# EasyEDA Pro project WEN正负电源LM27762.epro

# Schematic Schematic4
Board Name: 正负电源LM27762; Create Date: 2025-03-25; Page Name: P1; Project Name: 2025电赛预制模块mmkk; Schematic Name: Schematic4; Update Date: 2025-03-25; Company: 嘉立创EDA; Page Size: A1; Version: V1.0
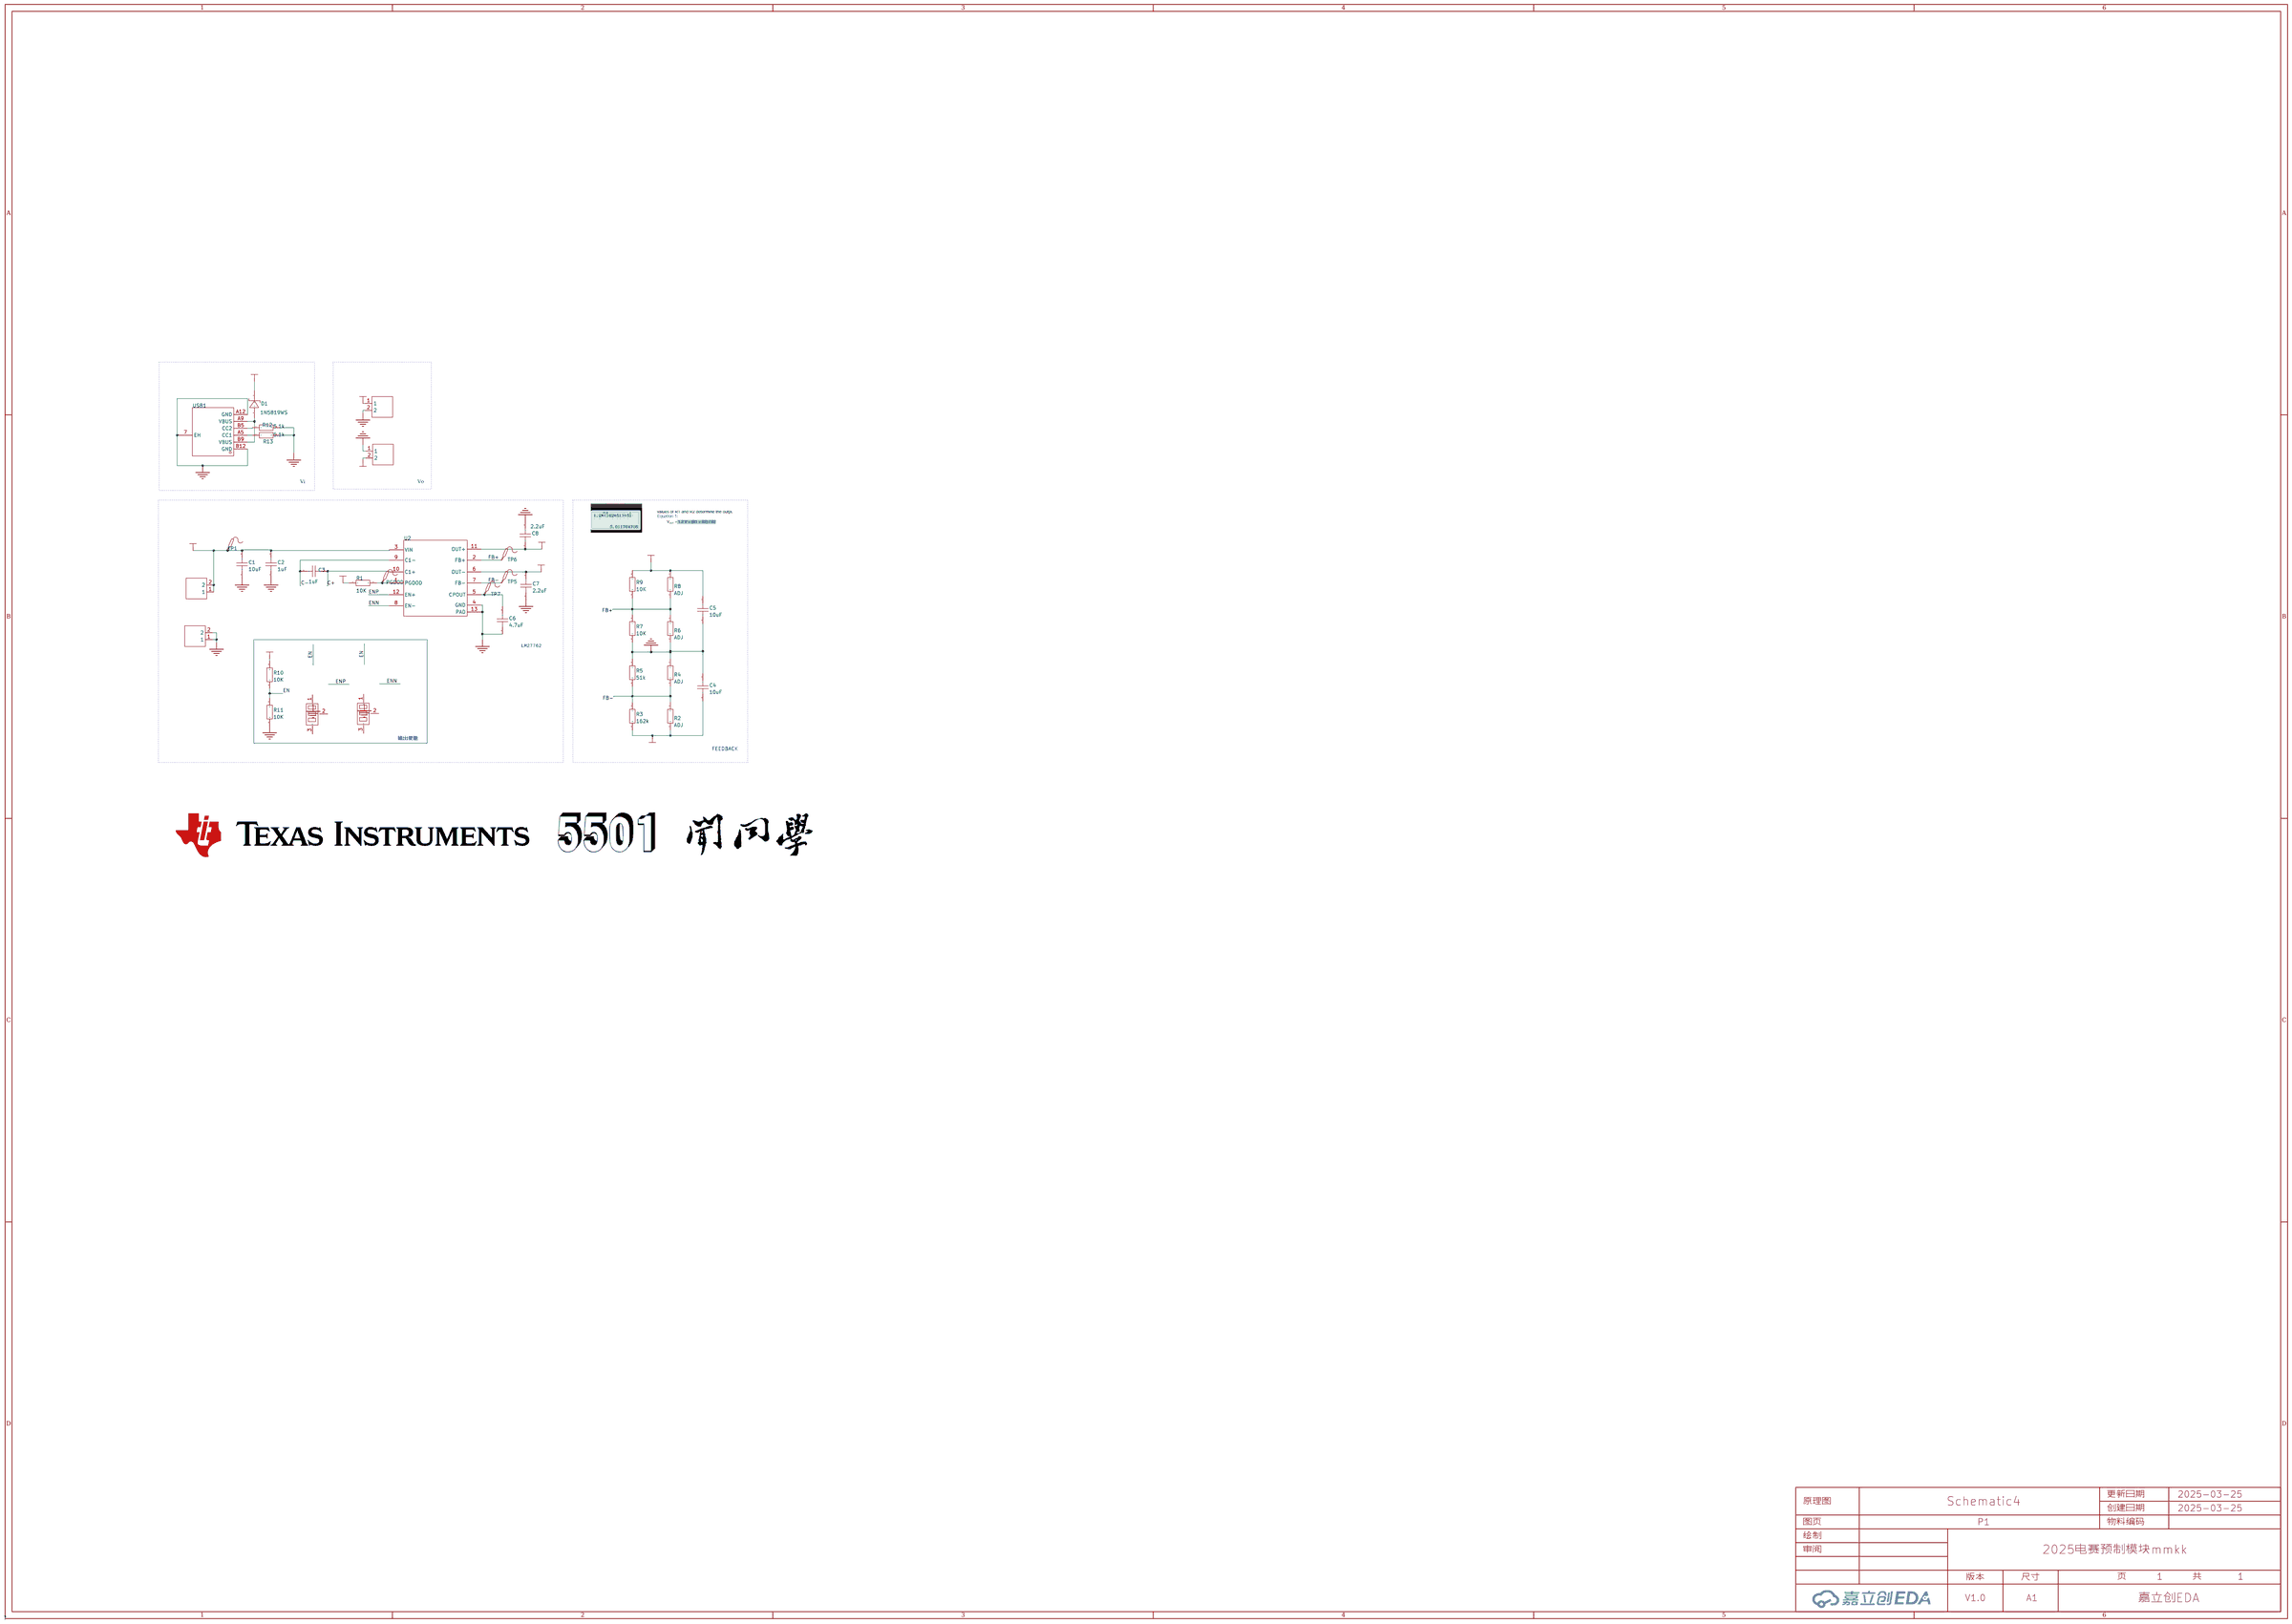
[diagram p0: schematic sheet]

## Parts
C1  10uF  [C0603]
C2  1uF  [C0603]
C3  1uF  [C0603]
C4  10uF  [C0603]
C5  10uF  [C0603]
C6  4.7uF  [C0603]
C7  2.2uF  [C0603]
C8  2.2uF  [C0603]
D1  1N5819WS  [SOD-323_L1.8-W1.3-LS2.5-RD]
H1  B-2100S02P-A110  [HDR-TH_2P-P2.54-V-M-1]
H2  B-2100S02P-A110  [HDR-TH_2P-P2.54-V-M-1]
H3  B-2100S02P-A110  [HDR-TH_2P-P2.54-V-M-1]
H4  B-2100S02P-A110  [HDR-TH_2P-P2.54-V-M-1]
PGOOD  -  [Test-Point-0.5mm]
R1  10K  [R0603]
R2  ADJ  [R0603]
R3  162k  [R0603]
R4  ADJ  [R0603]
R5  51k  [R0603]
R6  ADJ  [R0603]
R7  10K  [R0603]
R8  ADJ  [R0603]
R9  10K  [R0603]
R10  10K  [R0603]
R11  10K  [R0603]
R12  5.1k  [R0603]
R13  5.1k  [R0603]
TP1  -  [Test-Point-0.5mm]
TP5  -  [Test-Point-0.5mm]
TP6  -  [Test-Point-0.5mm]
TP7  -  [Test-Point-0.5mm]
U2  -  [WSON-12_L3.0-W2.0-P0.50-BL-EP]
U3  -  [切换短接焊盘]
U4  -  [切换短接焊盘]
USB1  TYPE-C 6P(073)  [TYPE-C-SMD_TYPE-C-6P_5]

## Library data of the parts
C1-C8 = CGA0603X5R106K100JT: 容值:10uF;精度:±10%;额定电压:10V;温度系数:X5R;; LCSC Part Name: 10uF ±10% 10V; Supplier Part: C6119842; Manufacturer: HRE(芯声); Supplier Footprint: 0603; JLCPCB Part Class: Extended Part; Supplier: LCSC; Tolerance: ±10%; Voltage Rating: 10V; Temperature Coefficient: X5R
D1 = 1N5819WS_C191023: 直流反向耐压(Vr):40V;平均整流电流(Io):1A;正向压降(Vf):600mV@1A;; LCSC Part Name: 40V 1A 600mV@1A; Supplier Part: C191023; Manufacturer: Hottech(合科泰); Supplier Footprint: SOD-323; JLCPCB Part Class: 基础库; Datasheet: https://atta.szlcsc.com/upload/public/pdf/source/20220428/3CB86FD8D28D653594B4E35F9D5AEFD9.pdf; Supplier: LCSC; Reverse Voltage (Vr): 40V; Average Rectified Current (Io): 1A; Forward Voltage (Vf@If): 600mV@1A
H1-H4 = B-2100S02P-A110: 插针结构:1x2P;间距:2.54mm;行距:-;圆针/方针:-;安装方式:直插;排数:单排;总PIN位数:2P;额定电流:-;额定电压:-;配合针长度:6mm;塑高:2.54mm;端接针长度:3mm;触头材质:黄铜;触头镀层:-;工作温度:-40℃~+105℃;颜色:黑色;; LCSC Part Name: 1x2P 间距:2.54mm 直插; Supplier Part: C124375; Manufacturer: Ckmtw(灿科盟); Supplier Footprint: 插件,P=2.54mm; JLCPCB Part Class: Extended Part; Datasheet: https://atta.szlcsc.com/upload/public/pdf/source/20221019/2EE72DAC61CAA62C0A53546E211F9C15.pdf; Supplier: LCSC; Pin Structure: 1x2P; Pitch: 2.54mm; Mounting Type: 直插; Number of Rows: 单排; Number of Pins: 2P; Length of Mating Pin: 6mm; Insulation Height: 2.54mm; Length of End Connection Pin: 3mm; Contact Material: 黄铜; Operating Temperature: -40℃~+105℃; Color: 黑色
PGOOD TP1 TP5-TP7 = Test-Point: Test Point 测试点
R1-R13 = 0603电阻
U2 = LM27762正负输出电荷泵
U3 U4 = 切换短接焊盘
USB1 = TYPE-C 6P(073): 连接器类型:Type-C;标准:USB 3.1;公母:母;安装方式:卧贴;触点数量:6P;端口数量:1;额定电流 - 电源:3A;工作温度范围:-25℃~+85℃;; LCSC Part Name: Type-C 母 卧贴; Supplier Part: C668623; Manufacturer: SHOU HAN(首韩); Supplier Footprint: SMD; JLCPCB Part Class: Extended Part; Datasheet: https://atta.szlcsc.com/upload/public/pdf/source/20200618/C668623_A4B260DED7AC1949BAC6AE39E9F4CD80.pdf; Supplier: LCSC; Connector Type: Type-C; Standard: USB 3.1; Gender: 母; Mounting Style: 卧贴; Number of Contacts: 6P; Number of Ports: 1; Current Rating - Power (Max): 3A; Operating Temperature Range: -25℃~+85℃; Rated Voltage (Max): 5V; Connect-Disconnect Life: 1万次; Core Colour: 黑色

## Nets
+5V: C5.1 C8.1 H2.1 R8.1 R9.1 U2.11(OUT+)
-5V: C4.2 C7.2 H3.2 R2.2 R3.2 U2.6(OUT-)
GND: C1.1 C2.1 C4.1 C5.2 C6.1 C7.1 C8.2 H2.2 H3.1 H4.1 H4.2 R4.1 R5.1 R6.2 R7.2 R11.1 R12.2 R13.2 U2.4(GND) U2.13(PAD) USB1.7(EH) USB1.A12(GND) USB1.B12(GND)
VIN: C1.2 C2.2 D1.1(C) H1.1 H1.2 R1.1 R10.2 TP1.1 U2.3(VIN)
C+: C3.1 U2.10(C1+)
C-: C3.2 U2.9(C1-)
EN: R10.1 R11.2
ENN: U2.8(EN-)
ENP: U2.12(EN+)
FB+: R6.1 R7.1 R8.2 R9.2 TP6.1 U2.2(FB+)
FB-: R2.1 R3.1 R4.2 R5.2 TP5.1 U2.7(FB-)
$1N857: PGOOD.1 R1.2 U2.1(PGOOD)
$1N3843: R12.1 USB1.B5(CC2)
$1N3847: R13.1 USB1.A5(CC1)
$1N3998: D1.2(A) USB1.A9(VBUS) USB1.B9(VBUS)
Net-(C6-2): C6.2 TP7.1 U2.5(CPOUT)

Not connected (* = marked no-connect by the designer): U3 1 2 3; U4 1 2 3

## Notes on the sheet
- Vi
- Vo
- LM27762
- 输出使能
- FEEDBACK

# Board LM27762
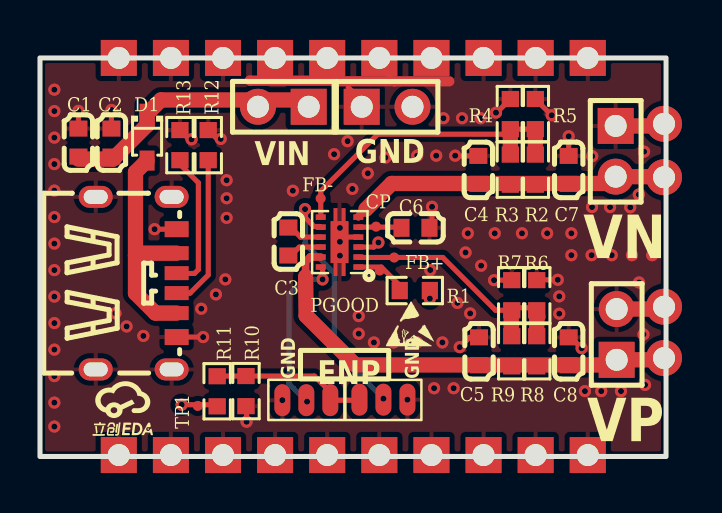
[diagram p1: board, top side]
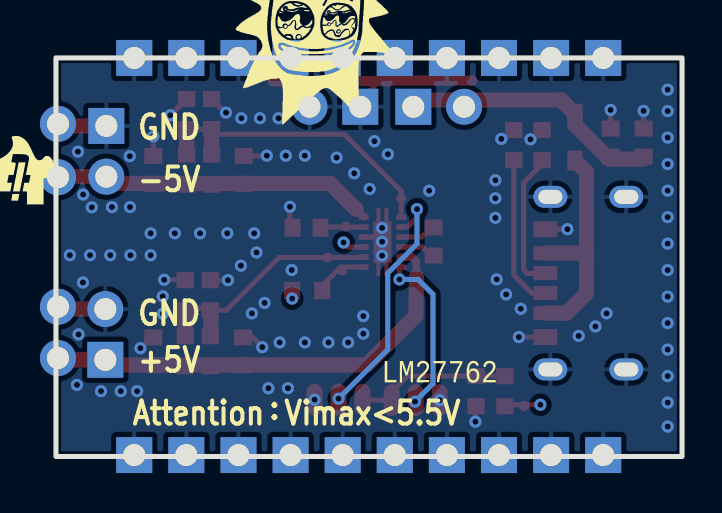
[diagram p2: board, bottom side, seen from below]

Outline 31.33 x 19.95 mm; copper layers: Top Layer, PWR, GND2, Bottom Layer. Coordinates in mm from the lower left corner of the outline.
Outline path: rectangle 0,19.95 31.33,0
Stack: Top Layer 0.035mm 外层铜厚1oz / Dielectric1 0.2104mm 7628 RC49% 8.6mil / PWR 0.0152mm 内层铜厚 / Dielectric2 1.065mm 1.1mm H/HOZ Copper / GND2 0.0152mm 内层铜厚 / Dielectric3 0.2104mm 7628 RC49% 8.6mil / Bottom Layer 0.035mm 外层铜厚1oz

## Design rules (mm)
template: 自定义配置
spacing copperThickness1oz: track to track 0.102, other pairs 0.152 to 0.3
spacing copperThickness2oz: track to track 0.203, other pairs 0.152 to 0.3
spacing 芜湖 (default): track to track 0.152, other pairs 0 to 0.3
track width copperThickness1oz (default): min 0.127, default 0.254, max 2.54
track width copperThickness2oz: min 0.203, default 0.254, max 2.54
differential pair differentialPair (default): width min 0.127, default 0.254, max 2.54; gap min 0.152, default 0.152
via viaSize (default): diameter min 0.5, default 0.61, max 10; hole min 0.3, default 0.305, max 6.3

## Placement (name value [footprint] x y rotation side)
C1  10uF  [C0603]  1.92 15.71 270 top
C2  1uF  [C0603]  3.58 15.71 270 top
C3  1uF  [C0603]  12.43 10.76 90 top
C4  10uF  [C0603]  21.94 14.34 270 top
C5  10uF  [C0603]  21.97 5.26 90 top
C6  4.7uF  [C0603]  18.79 11.45 180 top
C7  2.2uF  [C0603]  26.46 14.34 270 top
C8  2.2uF  [C0603]  26.46 5.26 90 top
CP  -  [Test-Point-0.5mm]  16.82 11.51 90 top
D1  1N5819WS  [SOD-323_L1.8-W1.3-LS2.5-RD]  5.36 15.98 270 top
FB+  -  [Test-Point-0.5mm]  17.73 9.96 90 top
FB-  -  [Test-Point-0.5mm]  14.05 12.92 90 top
H1  B-2100S02P-A110  [HDR-TH_2P-P2.54-V-M-1]  12.18 17.51 180 top
H2  B-2100S02P-A110  [HDR-TH_2P-P2.54-V-M-1]  28.86 6.11 90 top
H3  B-2100S02P-A110  [HDR-TH_2P-P2.54-V-M-1]  28.81 15.28 270 top
H4  B-2100S02P-A110  [HDR-TH_2P-P2.54-V-M-1]  17.37 17.51 0 top
NOREF  -  [Pad_e1611]  16.98 19.95 0 top
NOREF#2  -  [Pad_e1624]  16.98 0.07 0 top
NOREF#3  -  [Pad_e1623]  14.38 0.07 0 top
NOREF#4  -  [Pad_e1615]  27.41 19.95 0 top
NOREF#5  -  [Pad_e1619]  3.94 0.07 0 top
NOREF#6  -  [Pad_e1636]  31.23 13.98 0 top
NOREF#7  -  [Pad_e1626]  22.2 0.07 0 top
NOREF#8  -  [Pad_e1620]  6.55 0.07 0 top
NOREF#9  -  [Pad_e1610]  14.38 19.95 0 top
NOREF#10  -  [Pad_e1625]  19.59 0.07 0 top
NOREF#11  -  [Pad_e1628]  27.41 0.07 0 top
NOREF#12  -  [Pad_e1635]  31.23 7.5 0 top
NOREF#13  -  [Pad_e1621]  9.16 0.07 0 top
NOREF#14  -  [Pad_e1608]  9.16 19.95 0 top
NOREF#15  -  [Pad_e1637]  31.23 16.65 0 top
NOREF#16  -  [Pad_e1622]  11.77 0.07 0 top
NOREF#17  -  [Pad_e1612]  19.59 19.95 0 top
NOREF#18  -  [Pad_e1634]  31.23 4.93 0 top
NOREF#19  -  [Pad_e1627]  24.81 0.07 0 top
NOREF#20  -  [Pad_e1604]  3.94 19.95 0 top
NOREF#21  -  [Pad_e1613]  22.2 19.95 0 top
NOREF#22  -  [Pad_e1606]  6.55 19.95 0 top
NOREF#23  -  [Pad_e1614]  24.81 19.95 0 top
NOREF#24  -  [Pad_e1609]  11.77 19.95 0 top
PGOOD  -  [Test-Point-0.5mm]  17 9.31 0 top
R1  10K  [R0603]  18.76 8.31 180 top
R2  ADJ  [R0603]  24.79 14.36 270 top
R3  162k  [R0603]  23.54 14.36 270 top
R4  ADJ  [R0603]  23.54 17.14 270 top
R5  51k  [R0603]  24.79 17.14 270 top
R6  ADJ  [R0603]  24.86 8.07 90 top
R7  10K  [R0603]  23.61 8.07 90 top
R8  ADJ  [R0603]  24.86 5.27 90 top
R9  10K  [R0603]  23.61 5.27 90 top
R10  10K  [R0603]  8.87 3.26 270 top
R11  10K  [R0603]  10.31 3.27 90 top
R12  5.1k  [R0603]  8.42 15.59 90 top
R13  5.1k  [R0603]  7.01 15.59 90 top
TP1  -  [Test-Point-0.5mm]  7.9 2.53 90 top
U2  -  [WSON-12_L3.0-W2.0-P0.50-BL-EP]  14.99 10.73 90 top
U3  -  [切换短接焊盘]  14.44 2.87 270 top
U4  -  [切换短接焊盘]  16.08 2.79 90 top
USB1  TYPE-C 6P(073)  [TYPE-C-SMD_TYPE-C-6P_5]  4.81 8.68 270 top

## Footprints (pads in the part's own frame, mm; a bottom-side part is the same pattern mirrored in y, then rotated)
C0603
  rect 0.8x0.9 smd: 1(-0.7,0) 2(0.7,0)
HDR-TH_2P-P2.54-V-M-1
  rect 1.8x1.8 hole 1.1: 1(-1.27,0)
  round 1.8 hole 1.1: 2(1.27,0)
Pad_e1604
  rect 1.801x1.801 hole 1.1: 2(0,0)
Pad_e1606
  rect 1.801x1.801 hole 1.1: 2(0,0)
Pad_e1608
  rect 1.801x1.801 hole 1.1: 1(0,0)
Pad_e1609
  rect 1.801x1.801 hole 1.1: 2(0,0)
Pad_e1610
  rect 1.801x1.801 hole 1.1: 3(0,0)
Pad_e1611
  rect 1.801x1.801 hole 1.1: 4(0,0)
Pad_e1612
  rect 1.801x1.801 hole 1.1: 5(0,0)
Pad_e1613
  rect 1.801x1.801 hole 1.1: 6(0,0)
Pad_e1614
  rect 1.801x1.801 hole 1.1: 7(0,0)
Pad_e1615
  rect 1.801x1.801 hole 1.1: 8(0,0)
Pad_e1619
  rect 1.801x1.801 hole 1.1: 2(0,0)
Pad_e1620
  rect 1.801x1.801 hole 1.1: 2(0,0)
Pad_e1621
  rect 1.801x1.801 hole 1.1: 1(0,0)
Pad_e1622
  rect 1.801x1.801 hole 1.1: 2(0,0)
Pad_e1623
  rect 1.801x1.801 hole 1.1: 3(0,0)
Pad_e1624
  rect 1.801x1.801 hole 1.1: 4(0,0)
Pad_e1625
  rect 1.801x1.801 hole 1.1: 5(0,0)
Pad_e1626
  rect 1.801x1.801 hole 1.1: 6(0,0)
Pad_e1627
  rect 1.801x1.801 hole 1.1: 7(0,0)
Pad_e1628
  rect 1.801x1.801 hole 1.1: 8(0,0)
Pad_e1634
  round 1.801 hole 1.1: 9(0,0)
Pad_e1635
  round 1.801 hole 1.1: 9(0,0)
Pad_e1636
  round 1.801 hole 1.1: 9(0,0)
Pad_e1637
  round 1.801 hole 1.1: 9(0,0)
R0603
  rect 0.806x0.864 smd: 1(-0.753,0) 2(0.753,0)
SOD-323_L1.8-W1.3-LS2.5-RD
  rect 1x0.75 smd: 1(-1.173,0) 2(1.173,0)
Test-Point-0.5mm
  round 0.5 smd: 1(0,0)
TYPE-C-SMD_TYPE-C-6P_5
  oval 1.1x1.7 hole 0.7x1.2: 7(-4.32,1.775) 7(-4.32,-2.025) 7(4.32,1.775) 7(4.32,-2.025)
  rect 0.7x1.2 smd: A5(-0.5,2.025) A9(1.5,2.025) B5(0.5,2.025) B9(-1.5,2.025)
  rect 0.8x1.2 smd: A12(2.7,2.025) B12(-2.7,2.025)
WSON-12_L3.0-W2.0-P0.50-BL-EP
  rect 0.28x0.5 smd: 1(-1.25,-0.94) 2(-0.75,-0.94) 3(-0.25,-0.94) 4(0.25,-0.94) 5(0.75,-0.94) 6(1.25,-0.94) 7(1.25,0.94) 8(0.75,0.94) 9(0.25,0.94) 10(-0.25,0.94) 11(-0.75,0.94) 12(-1.25,0.94)
  custom 3.4x0.9 smd: 13(0,0)
切换短接焊盘
  oval 1.6x0.8 smd: 1(0.049,0.086) 2(0.049,-1.113) 3(0.049,-2.313)

## Nets
+5V: C5.1 C8.1 H2.1 NOREF#18.9 R8.1 R9.1 U2.11
-5V: C4.2 C7.2 H3.2 NOREF#6.9 R2.2 R3.2 U2.6
GND: C1.1 C2.1 C4.1 C5.2 C6.1 C7.1 C8.2 H2.2 H3.1 H4.1 H4.2 NOREF.4 NOREF#2.4 NOREF#3.3 NOREF#4.8 NOREF#5.2 NOREF#7.6 NOREF#8.2 NOREF#9.3 NOREF#10.5 NOREF#11.8 NOREF#12.9 NOREF#13.1 NOREF#14.1 NOREF#15.9 NOREF#16.2 NOREF#17.5 NOREF#19.7 NOREF#20.2 NOREF#21.6 NOREF#22.2 NOREF#23.7 NOREF#24.2 R4.1 R5.1 R6.2 R7.2 R11.1 R12.2 R13.2 U2.4 U2.13 U3.3 U4.3 USB1.7 USB1.A12 USB1.B12
VIN: C1.2 C2.2 D1.1 H1.1 H1.2 R1.1 R10.2 TP1.1 U2.3
C+: C3.1 U2.10
C-: C3.2 U2.9
EN: R10.1 R11.2 U3.1 U4.1
ENN: U2.8 U4.2
ENP: U2.12 U3.2
FB+: FB+.1 R6.1 R7.1 R8.2 R9.2 U2.2
FB-: FB-.1 R2.1 R3.1 R4.2 R5.2 U2.7
$1N857: PGOOD.1 R1.2 U2.1
$1N1511: C6.2 CP.1 U2.5
$1N3843: R12.1 USB1.B5
$1N3847: R13.1 USB1.A5
$1N3998: D1.2 USB1.A9 USB1.B9

## Via types
v1: diameter 0.61, hole 0.305, Top Layer to Bottom Layer, 99 vias

## Routing (per net, layer and track width the routed paths; a pad name or vN(x,y) marks a point on that pad's centre or on a via; arc(x,y) is an arc through that point)
+5V: length 21.8
  Top Layer w0.381: 13.29,9 13.29,9.76 13.52,9.98 U2.11
  Top Layer w0.762: 28.67,4.58 15.78,4.58 13.32,7.05 13.29,9 ; H2.1 30.57,4.84 30.65,4.93
-5V: length 15.6
  Top Layer w0.381: 15.93,12.01 15.94,12.01 16.31,12.38
  Top Layer w0.762: 30.65,13.98 30.62,14.01 H3.2 28.47,13.67 17.6,13.67 16.31,12.38
GND: length 34.5
  Top Layer w0.254: USB1.A12 v1(8.17,5.98) ; C2.1 v1(3.58,17.35) ; C1.1 v1(1.92,17.3) ; 8.42,16.34 8.86,15.9 v1(9.05,15.9) ; 7.01,16.34 7.47,15.87 v1(7.59,15.87) ; v1(19.62,12.5) 19.62,11.58 C6.1 ; v1(25.91,8.84) 24.88,8.84 R6.2 ; v1(27.11,5.42) 26.56,5.96 C8.2 ; R4.1 22.86,17.21 v1(22.82,17.21) ; U2.4 15.24,10.98 U2.13 ; 15.43,18.47 16.1,17.8 16.1,17.51 ; C4.1 20.78,15.05 ; v1(21.01,5.47) 21.5,5.96 C5.2 ; v1(25.61,17.08) 25.6,17.08 R5.1 ; R7.2 v1(22.73,8.83) ; v1(10.34,1.74) 10.34,2.49 R11.1 ; 16.98,19.53 17.73,18.78 ; 15.09,18.81 14.38,19.53 ; USB1.B12 v1(5.74,11.38) ; C7.1 v1(26.46,16.03)
  Top Layer w0.508: 20.49,18.78 17.73,18.78 17.73,18.78 14.73,18.78 14.7,18.81 ; 14.7,18.81 10.52,18.81 10.51,18.83 ; 14.7,18.81 15.09,18.81
  Top Layer w0.762: 30.65,16.65 30.55,16.55 H3.1 ; 30.65,7.5 30.54,7.38 H2.2
  vias: v1(0.72,18.36) v1(0.72,17.29) v1(0.72,15.96) v1(0.72,14.64) v1(0.72,13.31) v1(0.72,11.98) v1(0.72,10.66) v1(0.72,9.33) v1(0.72,8) v1(0.72,6.68) v1(0.72,5.35) v1(0.72,4.02) v1(0.72,2.7) v1(0.72,1.5) v1(3.78,7.16) v1(4.34,6.51) v1(5.17,6.04) v1(8.07,7.4) v1(8.8,8.11) v1(9.28,8.87) v1(9.34,13.83) v1(9.34,12.93) v1(9.34,11.94) v1(12.13,2.82) v1(12.66,13.3) v1(14.72,15.13) v1(15.01,11.44) v1(15.01,10.75) v1(15.01,10.05) v1(15.39,15.78) v1(15.63,13.39) v1(15.95,7.03) v1(15.95,6.15) v1(16.41,14.18) v1(16.71,5.71) v1(17.29,14.96) v1(17.69,5.71) v1(18.39,2.84) v1(18.88,15.06) v1(18.88,5.71) v1(19.53,9.33) v1(19.72,3.42) v1(19.83,15.06) v1(20.19,16.93) v1(20.14,5.71) v1(20.7,3.42) v1(20.78,15.06) v1(20.89,7.69) v1(21.12,16.93) v1(21.3,10.21) v1(21.41,11.17) v1(21.53,7.16) v1(22.06,16.93) v1(22.08,9.55) v1(22.76,11.17) v1(24.12,11.17) v1(25.38,11.17) v1(25.99,8.01) v1(25.99,7.15) v1(26.59,11.17) v1(26.59,10.08) v1(27.27,3.27) v1(27.61,10.08) v1(27.64,15.03) v1(27.63,12.48) v1(28.09,3.27) v1(28.53,12.48) v1(28.62,10.08) v1(29.08,3.27) v1(29.54,12.47) v1(29.63,10.08) v1(29.97,13.11) v1(29.98,8.71) v1(30.2,6.11) v1(30.23,15.26) v1(30.28,3.58) v1(30.64,10.08)
VIN: length 42.4
  Top Layer w0.254: 8.87,2.51 8.79,2.59 v1(7.09,2.59) ; U2.3 16.71,10.48 v1(16.94,10.71) ; 19.51,8.56 v1(19.51,7.9)
  Top Layer w0.762: H1.1 13.11,17.85 6.05,17.85 D1.1 5.36,16.59 3.65,14.89 1.92,14.89
  PWR w0.762: 17.54,9.89 17.54,10.11 v1(16.94,10.71) 13.46,14.19 13.45,14.19 H1.1 ; 17.54,9.89 10.22,2.58 10.21,2.59 v1(7.09,2.59) ; 17.54,9.89 17.54,9.87 v1(19.51,7.9)
C+: length 1.7
  Top Layer w0.254: 12.56,10.06 12.98,10.48 U2.10
C-: length 1.7
  Top Layer w0.254: U2.9 13.04,10.98 12.56,11.46
EN: length 7.9
  Top Layer w0.254: U4.1 15.96,2.82 U3.1 14.53,3.23 13.73,4.03 R11.2 8.88,4.03 R10.1
ENN: length 12.6
  Top Layer w0.254: U2.8 14.03,11.48 14,11.51 13.71,11.51 13.29,11.94 13.29,12.35 v1(13.27,12.38) ; U4.2 v1(17.19,2.89)
  Bottom Layer w0.254: v1(17.19,2.89) 14.73,5.36 14.73,9.18 13.27,10.64 v1(13.27,12.38)
ENP: length 8.3
  Top Layer w0.254: U2.12 14.14,9.39 v1(14.14,8.86) ; v1(13.37,2.75) 13.37,2.78 U3.2
  Bottom Layer w0.254: 13.95,8.86 13.21,8.86 12.46,8.12 12.46,3.65 v1(13.37,2.75)
FB+: length 11.9
  Top Layer w0.254: R7.1 22.8,7.32 20.16,9.96 15.95,9.96 U2.2 ; 24.86,7.45 23.61,7.45
  Top Layer w0.762: 23.58,6.28 23.58,7.19 ; R8.2 24.86,6.93 24.91,6.99
FB-: length 15.1
  Top Layer w0.254: R5.2 R4.2 23.29,16.13 16.9,16.13 14.05,13.28 U2.7
  Top Layer w0.762: 24.79,15.32 24.79,16.23 ; 23.54,15.37 23.54,16.28
$1N857: length 2.5
  Top Layer w0.254: 18,8.56 17.08,9.48 U2.1
$1N1511: length 2.3
  Top Layer w0.254: 17.91,11.12 17.91,11.48 U2.5
$1N3843: length 7.7
  Top Layer w0.254: USB1.B5 7.51,8.18 8.42,9.09 R12.1
$1N3847: length 7
  Top Layer w0.254: USB1.A5 6.86,9.16 7.73,9.16 7.93,9.36 7.93,13.7 7.01,14.62 R13.1
$1N3998: length 11.5
  Top Layer w0.762: D1.2 4.78,14.23 4.78,10.05 ; 4.78,10.05 4.78,8.17 5.78,7.18 USB1.A9 ; 4.78,10.05 4.91,10.18 USB1.B9

## Copper pours and planes (outline as drawn; the poured copper is in the pictures)
GND on Top Layer: -0.31,20.57 31.73,20.57 31.73,-0.32 -0.31,-0.32
GND on Bottom Layer: -0.09,19.82 31.23,19.82 31.23,-0.07 -0.09,-0.07
GND on PWR: -0.03,19.9 31.28,19.9 31.28,0.02 -0.03,0.02
GND on GND2: -0.2,19.79 31.12,19.79 31.12,-0.09 -0.2,-0.09

## Text on the board
Bottom Silkscreen Layer: GND | -5V | +5V | LM27762 | Attention：Vimax<5.5V
Top Silkscreen Layer: GND | VIN | ENP | VN | VP
